# Altium project project.PrjPcb
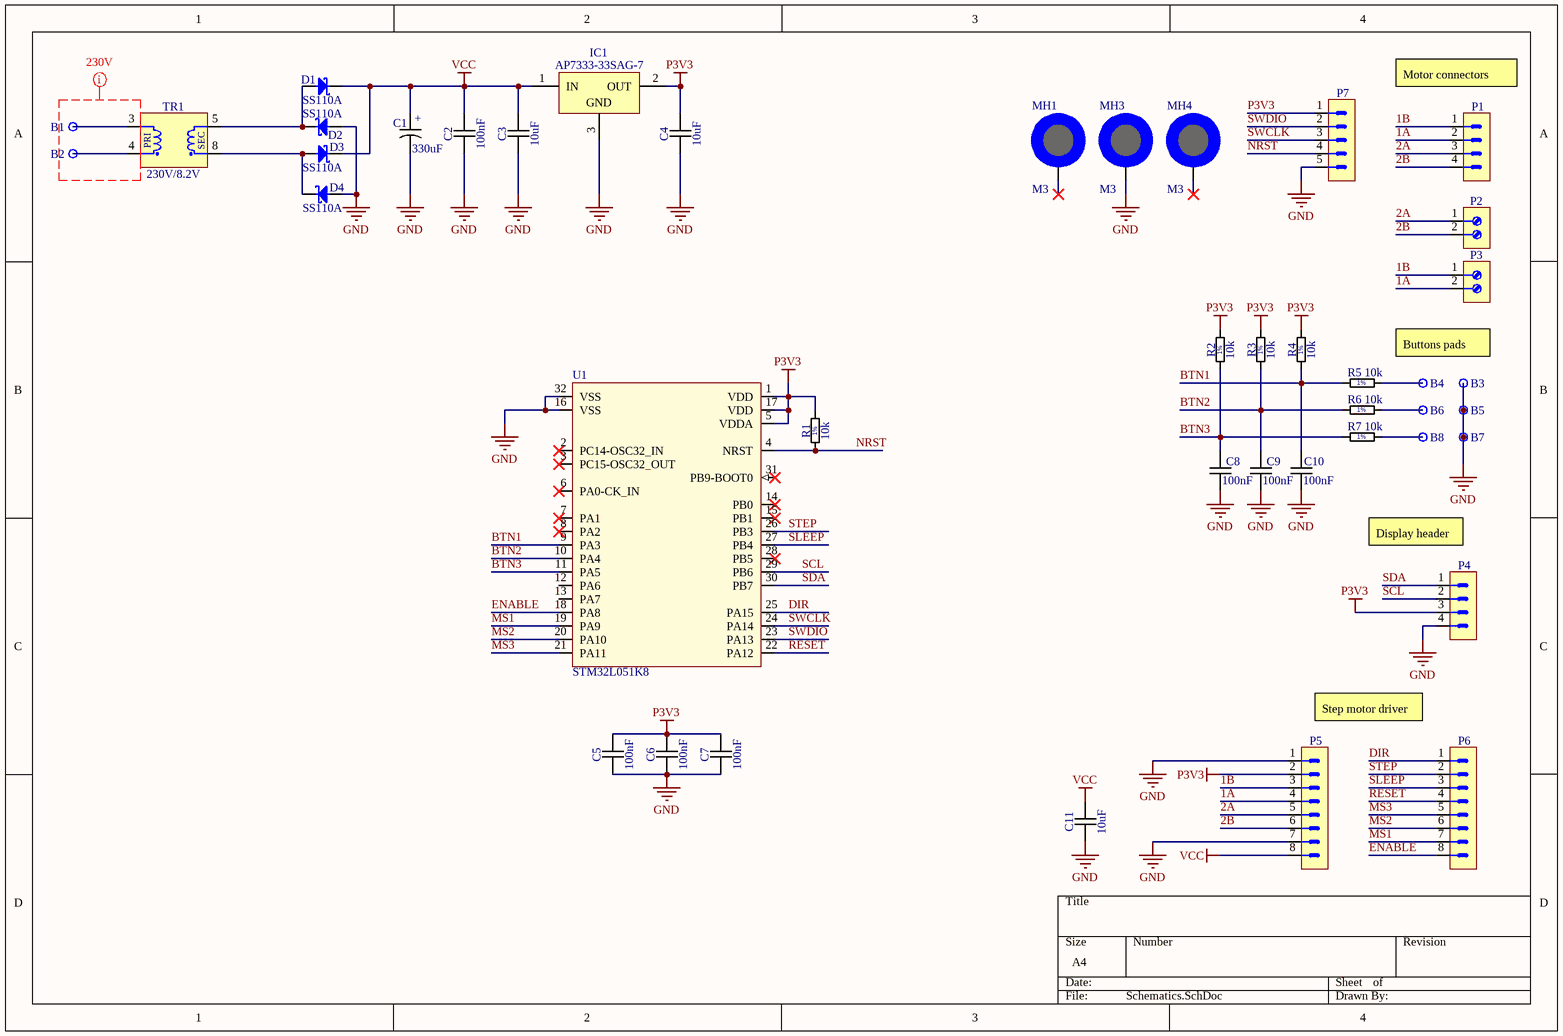
[diagram p0: Schematics.SchDoc]
1 sheet, 43 parts. Net scope: global (net labels, ports and power ports of the same name join across sheets).

## Sheet Schematics.SchDoc
size A4

### Parts
B1  Pad  [PAD_THD_C350H200MM]  (value not drawn)  (no BOM)
B2  Pad  [PAD_THD_C350H200MM]  (value not drawn)  (no BOM)
B3  Pad  [PAD_THD_C150H100MM]  (value not drawn)  (no BOM)
B4  Pad  [PAD_THD_C150H100MM]  (value not drawn)  (no BOM)
B5  Pad  [PAD_THD_C150H100MM]  (value not drawn)  (no BOM)
B6  Pad  [PAD_THD_C150H100MM]  (value not drawn)  (no BOM)
B7  Pad  [PAD_THD_C150H100MM]  (value not drawn)  (no BOM)
B8  Pad  [PAD_THD_C150H100MM]  (value not drawn)  (no BOM)
C1  330uF  [CAPPR5-10x16]
C2  100nF  [CAPC0603X90N]
C3  10uF  [CAPC0603X90N]
C4  10uF  [CAPC0603X90N]
C5  100nF  [CAPC0603X90N]
C6  100nF  [CAPC0603X90N]
C7  100nF  [CAPC0603X90N]
C8  100nF  [CAPC0603X90N]
C9  100nF  [CAPC0603X90N]
C10  100nF  [CAPC0603X90N]
C11  10uF  [CAPC0603X90N]
D1  SS110A  [DO-214AC - Schottky]
D2  SS110A  [DO-214AC - Schottky]
D3  SS110A  [DO-214AC - Schottky]
D4  SS110A  [DO-214AC - Schottky]
IC1  AP7333-33SAG-7  [SOT23-3]
MH1  M3  [MH-M3_COPPER_WASHER]  (no BOM)
MH3  M3  [MH-M3_COPPER_WASHER]  (no BOM)
MH4  M3  [MH-M3_COPPER_WASHER]  (no BOM)
P1  B4B-PH-K-S  [B4B-PH-K-S]  (value not drawn)
P2  1776275  [SCREWERM_THT_2X1H_3P5MM]  (value not drawn)
P3  1776275  [SCREWERM_THT_2X1H_3P5MM]  (value not drawn)
P4  SSW-104-02-L-S  [SAMTEC_SSW-104-02-L-S]  (value not drawn)
P5  68000-208HLF  [Header_8x1_V_2.54mm_M]  (value not drawn)
P6  68000-208HLF  [Header_8x1_V_2.54mm_M]  (value not drawn)
P7  SSW-105-02-G-S  [SAMTEC_SSW-105-02-G-S]  (value not drawn)
R1  10k  [RESC0603X60N]
R2  10k  [RESC0603X60N]
R3  10k  [RESC0603X60N]
R4  10k  [RESC0603X60N]
R5  10k  [RESC0603X60N]
R6  10k  [RESC0603X60N]
R7  10k  [RESC0603X60N]
TR1  230V/8.2V  [TS 2/14]
U1  STM32L051K8  [STM-LQFP32_N]

### Nets
GND: B3.1 B5.1 B7.1 C1.2 C2.1 C3.1 C4.1 C5.1 C6.1 C7.1 C8.1 C9.1 C10.1 C11.1 D2.2(A) D4.2(A) IC1.3(GND) MH3.MH P4.4 P5.1 P5.7 P7.5 U1.16(VSS) U1.32(VSS)
P3V3: C4.2 C5.2 C6.2 C7.2 IC1.2(OUT) P4.3 P5.2 P7.1 R1.2 R2.2 R3.2 R4.2 U1.1(VDD) U1.5(VDDA) U1.17(VDD)
VCC: C1.1 C2.2 C3.2 C11.2 D1.1(C) D3.1(C) IC1.1(IN) P5.8
1A: P1.2 P3.2 P5.4
1B: P1.1 P3.1 P5.3
2A: P1.3 P2.1 P5.5
2B: P1.4 P2.2 P5.6
BTN1: C10.2 R4.1 R5.1 U1.9(PA3)
BTN2: C9.2 R3.1 R6.1 U1.10(PA4)
BTN3: C8.2 R2.1 R7.1 U1.11(PA5)
DIR: P6.1 U1.25(PA15)
ENABLE: P6.8 U1.18(PA8)
MS1: P6.7 U1.19(PA9)
MS2: P6.6 U1.20(PA10)
MS3: P6.5 U1.21(PA11)
NRST: P7.4 R1.1 U1.4(NRST)
RESET: P6.4 U1.22(PA12)
SCL: P4.2 U1.29(PB6)
SDA: P4.1 U1.30(PB7)
SLEEP: P6.3 U1.27(PB4)
STEP: P6.2 U1.26(PB3)
SWCLK: P7.3 U1.24(PA14)
SWDIO: P7.2 U1.23(PA13)
NetB1_1: B1.1 TR1.3
NetB2_1: B2.1 TR1.4
NetB4_1: B4.1 R5.2
NetB6_1: B6.1 R6.2
NetB8_1: B8.1 R7.2
NetD1_2: D1.2(A) D2.1(C) TR1.5
NetD3_2: D3.2(A) D4.1(C) TR1.8

Not connected (* = marked no-connect by the designer): MH1 MH*; MH4 MH*; U1 2(PC14-OSC32_IN)* 3(PC15-OSC32_OUT)* 6(PA0-CK_IN)* 7(PA1)* 8(PA2)* 12(PA6) 13(PA7) 14(PB0)* 15(PB1)* 28(PB5)* 31(PB9-BOOT0)*

### Layout directives
rule Clearance Constraint [Clearance = 1.25mm]: (no net found under the mark)

### Notes on the sheet
- (near P1) Motor connectors
- Buttons pads
- (near P4) Display header
- Step motor driver
- (in symbol CE_THT_5-10X16_330UF_50V_20%) +
- (in symbol TS 2/14) PRI; SEC

### Library data of the parts
B1 B2 = PAD_THD_C350H200MM: Plated Through Hole: Hole Dia.=2mm Pad Dia.=3.5mm; DesignItemId: PAD_THD_C350H200MM; Author: KB; Family: Pad; Part Description: Plated Through Hole: Hole Dia.=2mm Pad Dia.=3.5mm; Create Date: 11.05.2019; LatestRevisionDate: 11.05.2019
B3-B8 = PAD_THD_C150H100MM: Plated Through Hole: Hole Dia.=1mm Pad Dia.=1.5mm; DesignItemId: PAD_THD_C150H100MM; Author: KB; Family: Pad; Part Description: Plated Through Hole: Hole Dia.=1mm Pad Dia.=1.5mm; Create Date: 11.05.2019; LatestRevisionDate: 11.05.2019
C1 = CE_THT_5-10X16_330UF_50V_20%: Polarised capacitor; Manufacturer: GENERIC; Manufacturer 1 Example: Illinois Capacitor / CDE; Manufacturer 1 Part Number: 337CKS050M; Manufacturer 1 Component Height: 16mm; PressFit: No; Tolerance: 20%; Voltage: 50V; DesignItemId: CE_THT_5-10X16_330UF_50V_20%; Author: UN; Case: Radial 5mm-10x16mm; Component Kind: Standard; HelpURL: https://pl.mouser.com/datasheet/2/88/CKR_CKS_series-553026.pdf; Manufacturer Part Number: CE_THT_5-10X16_330UF_50V_20%; Mounted: Yes; Part Description: Polarised capacitor; Pin Count: 2; Sense: No; SMD: No; Socket: No; Status: Recommended; Value: 330uF; Supplier 1: Mouser; Supplier 2: Digi-Key; Create Date: 16.10.2019; LatestRevisionDate: 16.10.2019; Supplier Part Number 1: 598-337CKS050M; Supplier Part Number 2: 1572-1438-ND
C2 C5-C10 = CC0603_100NF_16V_10%_X7R: Non-polarised capacitor; Manufacturer: GENERIC; Manufacturer 1 Example: Vishay; Manufacturer 1 Part Number: VJ0603Y104KXJCW1BC; Manufacturer 1 Component Height: 0.8mm; PressFit: No; Dielectric: X7R; Tolerance: 10%; Voltage: 16V; DesignItemId: CC0603_100NF_16V_10%_X7R; Author: KB; Case: 0603 (1608 metric); Component Kind: Standard; HelpURL: https://www.vishay.com/docs/28548/vjw1bcbascomseries.pdf; Manufacturer Part Number: CC0603_100NF_16V_10%_X7R; Mounted: Yes; Part Description: Non-polarised capacitor; Pin Count: 2; Sense: No; SMD: Yes; Socket: No; Status: Recommended; Value: 100nF; Supplier 1: Farnell; Supplier 2: TME; Supplier 3: Mouser; Create Date: 01.04.2019; LatestRevisionDate: 01.04.2019; Supplier Part Number 1: 2896425; Supplier Part Number 2: VJ0603Y104KXJCW1BC; Supplier Part Number 3: 710-885012206046
C3 C4 C11 = CC0603_10UF_16V_20%_X5R: Non-polarised capacitor; Manufacturer: GENERIC; Manufacturer 1 Example: Samsung; Manufacturer 1 Part Number: CL10A106MO8NQNC; Manufacturer 1 Component Height: 0.8mm; PressFit: No; Dielectric: X5R; Tolerance: 20%; Voltage: 16V; DesignItemId: CC0603_10UF_16V_20%_X5R; Author: KB; Case: 0603 (1608 metric); Component Kind: Standard; HelpURL: https://www.vishay.com/docs/28548/vjw1bcbascomseries.pdf; Manufacturer Part Number: CC0603_10UF_16V_20%_X5R; Mounted: Yes; Part Description: Non-polarised capacitor; Pin Count: 2; Sense: No; SMD: Yes; Socket: No; Status: Recommended; Value: 10uF; Supplier 1: Farnell; Supplier 2: TME; Supplier 3: Mouser; Create Date: 01.04.2019; LatestRevisionDate: 01.04.2019; Supplier Part Number 1: 2611923; Supplier Part Number 2: CL10A106MO8NQNC; Supplier Part Number 3: 81-GRM188R61C106KALD
D1-D4 = SS110A: Surface Mount Schottky Rectifier; Manufacturer 1 Example: YANGJIE TECHNOLOGY; Manufacturer 1 Component Height: 2.1mm; PressFit: No; DesignItemId: SS110A; Author: JK; Device: SS110A; Component Kind: Standard; Footprint: DO-214AC; HelpURL: https://www.tme.eu/Document/f86dbf25808a64c8f6899aa01bdfadcb/SS12A_SER.pdf; Manufacturer 1 Part Number: SS110A; Mounted: Yes; Part Description: Surface Mount Schottky Rectifier; Pin Count: 2; Sense: No; SMD: Yes; Socket: No; Supplier 1: TME; Create Date: 24.04.2020; LatestRevisionDate: 24.04.2020; Supplier Part Number 1: SS110A-YAN
IC1 = AP7333-33SAG-7: 3.3V, 0.3A output; Vin 6V max, 0.3V dropout; Manufacturer 1 Example: DIODES INCORPORATED; Manufacturer 1 Component Height: 1.45mm; PressFit: No; DesignItemId: AP7333-33SAG-7; Author: BS; Device: AP7333-33SAG-7; Component Kind: Standard; HelpURL: https://www.tme.eu/Document/7cdd3961abdbf22d69f4b7af2917b5be/AP7333.pdf; Manufacturer 1 Part Number: AP7333-33SAG-7; Mounted: Yes; Part Description: 3.3V, 0.3A output; Vin 6V max, 0.3V dropout; Pin Count: 3; Sense: No; SMD: Yes; Socket: No; Supplier 1: TME; Supplier 2: Mouser; Create Date: 08.10.2019; LatestRevisionDate: 08.10.2019; Supplier Part Number 1: AP7333-33SAG-7
MH1 MH3 MH4 = MH-M3_CW: Mounting hole, M3, exposed pad, space for washer; DesignItemId: MH-M3_CW; Author: KB; Family: M3; Part Description: Mounting hole, M3, exposed pad, space for washer; Create Date: 11.05.2019; LatestRevisionDate: 11.05.2019
P1 = PH-K-S_4X1V_2P0MM: 2mm header socket, vertical, 4 Positions, THT, 9.9x4.5mm body; Manufacturer: GENERIC; Manufacturer 1 Example: JST; Manufacturer 1 Component Height: 6mm; Current Max: 2A; PressFit: No; Voltage Max: 100V; DesignItemId: PH-K-S_4X1V_2P0MM; Author: KB; Family: PH-K-S; Component Kind: Standard; HelpURL: https://www.tme.eu/Document/bde47a97a79ef7b2143e7f603cd40725/PH.pdf; Manufacturer Part Number: B4B-PH-K-S; Manufacturer 1 Part Number: B4B-PH-K-S; Mounted: Yes; Part Description: 2mm header socket, vertical, 4 Positions, THT, 9.9x4.5mm body; Pin Count: 4; Sense: No; SMD: No; Socket: No; Status: Recommended; Supplier 1: TME; Supplier 2: Farnell; Create Date: 19.03.2012; LatestRevisionDate: 19.03.2012; Supplier Part Number 1: B4B-PH-K-S; Supplier Part Number 2: 9492437
P2 P3 = SCREWERM_THT_2X1H_3P5MM: Terminal Block, Right angle, 2 Positions, THT, Screw Connection, 7x7mm body; Manufacturer: GENERIC; Manufacturer 1 Example: TE Connectivity; Manufacturer 1 Part Number: 1776275-2; Manufacturer 1 Component Height: 8.3mm; Current Max: 7A; PressFit: No; Voltage Max: 250V; DesignItemId: SCREWERM_THT_2X1H_3P5MM; Author: JK; Family: 1776275; Component Kind: Standard; HelpURL: https://www.tme.eu/Document/7b0ef2ac8bc0c4f2c9b8dae3b21b7e62/1776275-2.pdf; Manufacturer Part Number: SCREWERM_THT_2X1H_3P5MM; Mounted: Yes; Part Description: Terminal Block, Right angle, 2 Positions, THT, Screw Connection, 7x7mm body; Pin Count: 2; Sense: No; SMD: No; Socket: No; Status: Recommended; Supplier 1: TME; Create Date: 11.01.2020; LatestRevisionDate: 11.01.2020; Supplier Part Number 1: 1776275-2
P4 = HDR_THT_4X1V_F_2P54MM: General Purpose Header: THT, 2.54mm, Female, Straight; Manufacturer: GENERIC; Manufacturer 1 Example: Samtec; Manufacturer 1 Component Height: 9.78mm; Current Max: 4.7A; PressFit: No; DesignItemId: HDR_THT_4X1V_F_2P54MM; Author: PC; Family: SSW; Component Kind: Standard; Footprint: HDR_4X1V_F_2P54MM; HelpURL: https://pl.mouser.com/datasheet/2/527/ssw_th-1507658.pdf; Manufacturer Part Number: HDR_THT_4X1V_F_2P54MM; Manufacturer 1 Part Number: SSW-104-02-L-S; Mounted: Yes; Part Description: General Purpose Header: THT, 2.54mm, Female, Straight; Pin Count: 4; Sense: No; SMD: No; Socket: No; Status: Recommended; Supplier 1: Mouser; Supplier 2: Digi-Key; Create Date: 19.08.2012; LatestRevisionDate: 19.08.2012; Supplier Part Number 1: 200-SSW10402LSRA
P5 P6 = HDR_THT_8X1V_M_2P54MM: General Purpose Header: THT, 2.54mm, Male, Straight; Manufacturer: GENERIC; Manufacturer 1 Example: AMPHENOL; Manufacturer 1 Component Height: 6.7mm; PressFit: No; DesignItemId: HDR_THT_8X1V_M_2P54MM; Author: JK; Family: HTSW; Component Kind: Standard; HelpURL: https://www.tme.eu/Document/deb83b8ba474aa6382ee38bb24abad5e/68000-XXXXLF.pdf; Manufacturer Part Number: Header_8x1_V_2.54mm_M; Manufacturer 1 Part Number: 68000-208HLF; Mounted: Yes; Part Description: General Purpose Header: THT, 2.54mm, Male, Straight; Pin Count: 8; Sense: No; SMD: No; Socket: No; Status: Recommended; Supplier 1: TME; Create Date: 17.12.2019; LatestRevisionDate: 17.12.2019; Supplier Part Number 1: 68000-208HLF
P7 = HDR_THT_5X1V_F_2P54MM: General Purpose Header: THT, 2.54mm, Female, Straight, Long Lead; Manufacturer: GENERIC; Manufacturer 1 Example: Samtec; Manufacturer 1 Component Height: 11.55mm; Current Max: 3A; PressFit: No; DesignItemId: HDR_THT_5X1V_F_2P54MM; Author: UN; Family: SSW; Component Kind: Standard; Footprint: HDR_5X1V_F_2P54MM; HelpURL: https://pl.mouser.com/datasheet/2/527/ssw_th-1507658.pdf; Manufacturer Part Number: HDR_THT_5X1V_F_2P54MM; Manufacturer 1 Part Number: SSW-105-02-G-S; Mounted: Yes; Part Description: General Purpose Header: THT, 2.54mm, Female, Straight, Long Lead; Pin Count: 5; Sense: No; SMD: No; Socket: No; Status: Recommended; Supplier 1: TME; Supplier 2: Mouser; Create Date: 19.08.2014; LatestRevisionDate: 19.08.2014; Supplier Part Number 1: ZL262-5SG
R1-R7 = R0603_10K0_0.1W_100PPM: General Purpose Thick Film Chip Resistor; Manufacturer: GENERIC; Manufacturer Part Number: R0603_10K0_0.0625W 0.1W 0.125W 0.25W 0.5W 1W 0.75W 1W_100PPM; Manufacturer 1 Example: Vishay; Manufacturer 1 Part Number: CRCW060310K0FKEDC; Manufacturer 1 Component Height: 0.5mm; Power: 100mW; Current Max: 0; PressFit: No; TC: ?100 ppm/?C; Tolerance: 1%; Voltage: 75V; DesignItemId: R0603_10K0_0.1W_100PPM; Author: KB; Case: 0603 (1608 metric); Component Kind: Standard; Component Type: Standard; HelpURL: https://www.vishay.com/docs/20035/dcrcwe3.pdf; Mounted: Yes; Part Description: General Purpose Thick Film Chip Resistor; Pin Count: 2; Sense: No; SMD: Yes; Socket: No; Status: Recommended; Value: 10k; Supplier 1: Farnell; Supplier 2: TME; Supplier 3: Mouser; Create Date: 03.07.2019; LatestRevisionDate: 03.07.2019
TR1 = TS 2/14: Transformer; Manufacturer: INDEL; Manufacturer 1 Component Height: 28.5mm; PressFit: No; Max Power: 2VA; DesignItemId: TS 2/14; Author: JK; Case: TS 2/14; Component Kind: Standard; HelpURL: https://www.tme.eu/Document/ef0b0bfa1a568056a0745f8e867b1088/36_1.pdf; Manufacturer Part Number: TS 2/14; Manufacturer 1 Example: INDEL; Manufacturer 1 Part Number: TS 2/14; Mounted: Yes; Part Description: Transformer; Pin Count: 5; Sense: No; SMD: No; Socket: No; Status: Recommended; Value: 230V/8.2V; Supplier 1: TME; Create Date: 12.06.2020; LatestRevisionDate: 12.06.2020; Supplier Part Number 1: TS2/14
U1 = STM32L051K8: Ultra-low-power ARM Cortex-M0+ MCU with 64 Kbytes Flash, 32 MHz CPU; Manufacturer 1 Example: STMicroelectronics; Manufacturer 1 Part Number: STM32L051K8T6; Manufacturer 1 Component Height: 1.6mm; PressFit: No; DesignItemId: STM32L051K8; Author: JK; Device: STM32L051K8; Component Kind: Standard; Footprint: LQFP-32; HelpURL: https://www.st.com/resource/en/datasheet/stm32l051k8.pdf; Mounted: Yes; Part Description: Ultra-low-power ARM Cortex-M0+ MCU with 64 Kbytes Flash, 32 MHz CPU; Pin Count: 32; Sense: No; SMD: Yes; Socket: No; Supplier 1: Mouser; Create Date: 02.01.2020; LatestRevisionDate: 02.01.2020; Supplier Part Number 1: 511-STM32L051K8T6